# EAGLE schematic brobot19 (EAGLE 6.6.0)
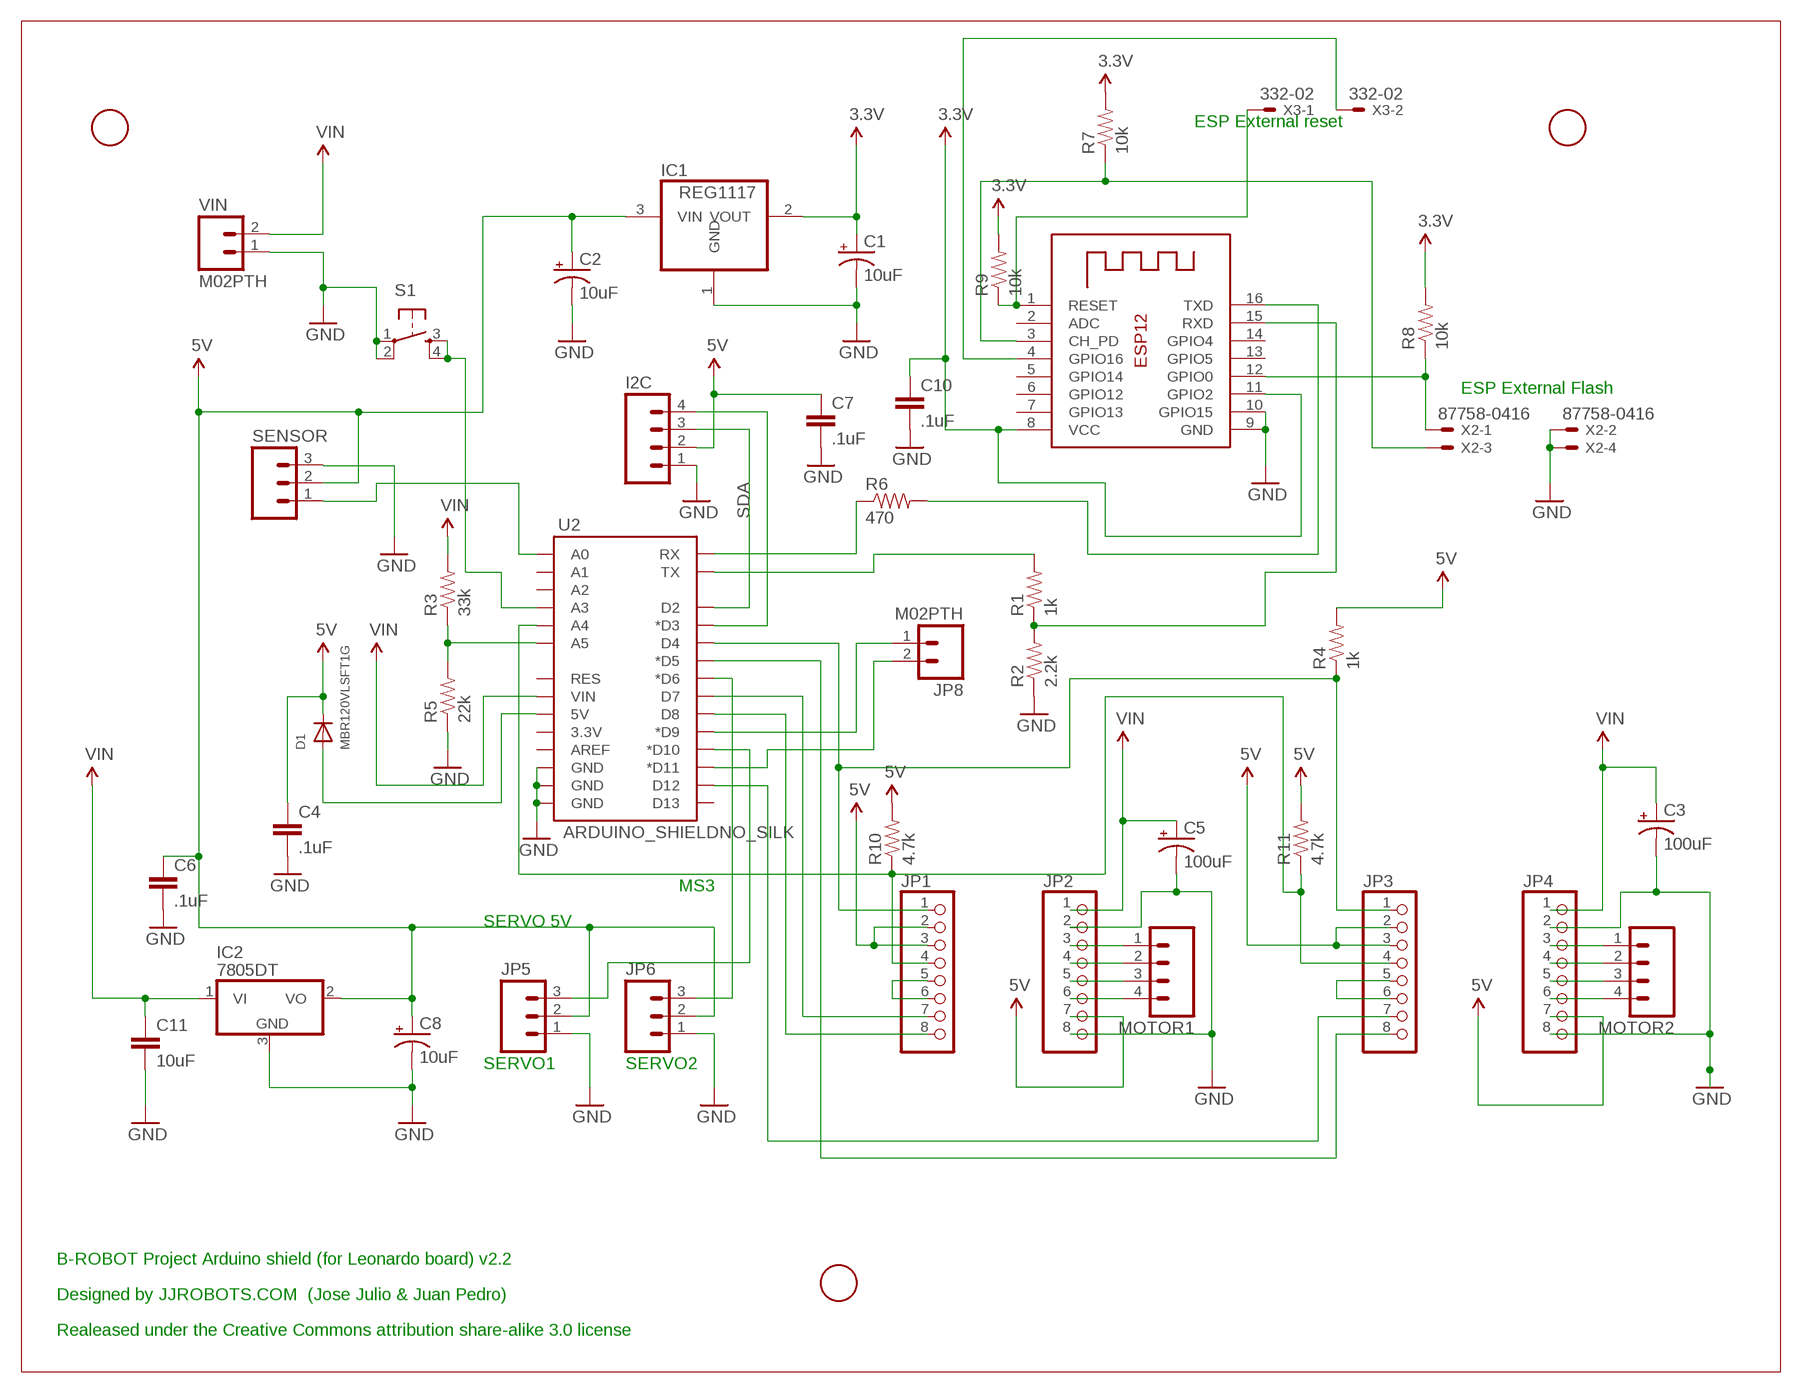
[diagram p0: schematic, sheet 1]

## Parts
C1  10uF  CAP_POL1206  [EIA3216]
C2  10uF  CAP_POL1206  [EIA3216]
C3  100uF  CAP_POLD  [PANASONIC_D]
C4  .1uF  CAP0402-CAP  [0402-CAP]
C5  100uF  CAP_POLD  [PANASONIC_D]
C6  .1uF  CAP0402-CAP  [0402-CAP]
C7  .1uF  CAP0402-CAP  [0402-CAP]
C8  10uF  CAP_POL1206  [EIA3216]
C10  .1uF  CAP0402-CAP  [0402-CAP]
C11  10uF  CAP1206  [1206]
D1  MBR120VLSFT1G  DIODESOD-123  [SOD-123]
I2C  M04PTH  [1X04]
IC1  REG1117  [SOT223]
IC2  7805DT  [TO252]
JP1  PINHD-1X8  [1X08]
JP2  PINHD-1X8  [1X08]
JP3  PINHD-1X8  [1X08]
JP4  PINHD-1X8  [1X08]
JP5  M03PTH  [1X03]
JP6  M03PTH  [1X03]
JP8  M02PTH  [1X02]
MOTOR1  M04PTH  [1X04]
MOTOR2  M04PTH  [1X04]
R1  1k  RESISTOR0805-RES  [0805]
R2  2.2k  RESISTOR0805-RES  [0805]
R3  33k  RESISTOR0805-RES  [0805]
R4  1k  RESISTOR0805-RES  [0805]
R5  22k  RESISTOR0805-RES  [0805]
R6  470  RESISTOR0805-RES  [0805]
R7  10k  RESISTOR0805-RES  [0805]
R8  10k  RESISTOR0805-RES  [0805]
R9  10k  RESISTOR0805-RES  [0805]
R10  4.7k  RESISTOR0805-RES  [0805]
R11  4.7k  RESISTOR0805-RES  [0805]
S1  TAC_SWITCHSMD  [TACTILE-SWITCH-SMD]
SENSOR  M03PTH  [1X03]
U2  ARDUINO_SHIELDNO_SILK  [DUEMILANOVE_VIAS]
U$1  FIDUCIAL  [FIDUCIAL_1MM]
U$2  FIDUCIAL  [FIDUCIAL_1MM]
U$3  FIDUCIAL  [FIDUCIAL_1MM]
VIN  M02PTH  [1X02]
X1  ESP-12  [ESP-12]
X2  87758-0416  [87758-0416]
X3  332-02  [332-02]

## Nets
3.3V: C1.A(+) C10.1 IC1.2(VOUT) R7.2 R8.2 R9.2 X1.8(VCC) X1.11(GPIO2)
5V: C2.A(+) C4.1 C6.1 C7.1 C8.A(+) D1.C I2C.2 IC1.3(VIN) IC2.2(VO) JP1.2 JP1.3 JP2.7 JP3.2 JP3.3 JP4.7 JP5.2 JP6.2 R4.2 R10.2 R11.2 SENSOR.2
GND: C1.C(-) C2.C(-) C3.- C4.2 C5.- C6.2 C7.2 C8.C(-) C10.2 C11.2 I2C.1 IC1.1(GND) IC2.3(GND) JP2.2 JP2.8 JP4.2 JP4.8 JP5.1 JP6.1 R2.1 R5.1 S1.1 S1.2 SENSOR.3 U2.GND@0(GND) U2.GND@1(GND) U2.GND@2(GND) VIN.1 X1.9(GND) X1.10(GPIO15) X2.2 X2.4
N$1: JP2.3 MOTOR1.1
N$2: JP2.4 MOTOR1.2
N$3: R6.2 X1.16(TXD)
N$4: R1.1 R2.2 X1.15(RXD)
N$5: R1.2 U2.TX
N$6: JP2.5 MOTOR1.3
N$7: JP2.6 MOTOR1.4
N$8: JP4.3 MOTOR2.1
N$9: JP4.4 MOTOR2.2
N$10: JP4.5 MOTOR2.3
N$11: JP1.5 JP1.6
N$12: JP3.5 JP3.6
N$13: R3.1 R5.2 U2.A5
N$14: R6.1 U2.RX
N$15: SENSOR.1 U2.A0
N$16: JP4.6 MOTOR2.4
N$17: JP6.3 U2.D6(*D6)
N$18: R7.1 X1.3(CH_PD) X2.3
N$19: JP5.3 U2.D10(*D10)
N$20: R8.1 X1.12(GPIO0) X2.1
N$21: JP1.8 U2.D8
N$22: JP1.7 U2.D7
N$23: JP1.1 JP3.1 R4.1 U2.D4
N$24: JP3.8 U2.D5(*D5)
N$25: JP3.7 U2.D12
N$26: D1.A U2.5V
N$27: JP8.1 U2.D9(*D9)
N$28: JP8.2 U2.D11(*D11)
N$29: R9.1 X1.1(RESET) X3.1
N$30: X1.4(GPIO16) X3.2
N$31: JP1.4 JP3.4 R10.1 R11.1 U2.A4
N$32: S1.3 S1.4 U2.A3
SCL: I2C.4 U2.D3(*D3)
SDA: I2C.3 U2.D2
VIN: C3.+ C5.+ C11.1 IC2.1(VI) JP2.1 JP4.1 R3.2 U2.VIN VIN.2
Unconnected: U2.3.3V U2.A1 U2.A2 U2.AREF U2.D13 U2.RES X1.2(ADC) X1.5(GPIO14) X1.6(GPIO12) X1.7(GPIO13) X1.13(GPIO5) X1.14(GPIO4)

## Notes on the sheet
- ESP External reset
- ESP External Flash
- MS3
- SERVO 5V
- SERVO1 | SERVO2
- B-ROBOT Project Arduino shield (for Leonardo board) v2.2
- Designed by JJROBOTS.COM  (Jose Julio & Juan Pedro)
- Realeased under the Creative Commons attribution share-alike 3.0 license

## Library data of the parts
C1-C3 C5 C8 = SparkFun-Passives:CAP_POL: Capacitor Polarized These are standard SMD and PTH capacitors. Normally 10uF, 47uF, and 100uF in electrolytic and tantalum varieties. Always verify the external diameter of the through hole cap, it varies with capacity, voltage, and manufacturer. The EIA devices should be standard.
C4 C6 C7 C10 C11 = SparkFun-Passives:CAP: Capacitor Standard 0603 ceramic capacitor, and 0.1" leaded capacitor.
D1 = adafruit:DIODE: Diode SMADIODE - SMA Surface Mount Package 20V 1A Schottky Diode Digikey: 641-1014-6-ND DO-1N4148 - Through Hole Small Current Diode SOD-123 20V 1 A (.5mV Vf) Schottky Diode - Digikey: MBRX120TPMSCT-ND SOD-323 10V 570mA (.38mV Vf, 3ns) Schottky Diode - Digikey: ZLLS410CT-ND SOD-523 30V 30mA Schottky Diode (RB751S-40TE61) - Digikey: RB751S-40TE61CT-ND SOT23-R/W - SOT23 Package (R = Solder Paste/Reflow Ovens, W = Hand-Soldering) BAT54Film 40V 300mA - Digikey: 497-7162-1-ND
I2C MOTOR1 MOTOR2 = SparkFun-Connectors:M04: Header 4 Standard 4-pin 0.1" header. Use with straight break away headers (SKU : PRT-00116), right angle break away headers (PRT-00553), swiss pins (PRT-00743), machine pins (PRT-00117), and female headers (PRT-00115). Molex polarized connector foot print use with SKU : PRT-08231 with associated crimp pins and housings. 1MM SMD Version SKU: PRT-10208
IC1 = burr-brown:REG1117: 800mA and 1A Low Dropout (LDO) Positive Regulator 1.8V, 2.5V, 2.85V, 3.3V, 5V, and Adj; MF: LM1117MPX-3.3/NOPB; MPN: REG1117; OC_FARNELL: 1097566; OC_NEWARK: 14P6981
IC2 = linear:78*: Positive VOLTAGE REGULATOR Source: http://cache.national.com/ds/LM/LM78L05.pdf http://www.fairchildsemi.com/ds/LM/LM7805.pdf
JP1-JP4 = pinhead:PINHD-1X8: PIN HEADER
JP5 JP6 SENSOR = SparkFun-Connectors:M03: Header 3 Standard 3-pin 0.1" header. Use with straight break away headers (SKU : PRT-00116), right angle break away headers (PRT-00553), swiss pins (PRT-00743), machine pins (PRT-00117), and female headers (PRT-00115). Molex polarized connector foot print use with SKU : PRT-08232 with associated crimp pins and housings.
JP8 VIN = SparkFun-Connectors:M02: Standard 2-pin 0.1" header. Use with - straight break away headers ( PRT-00116) - right angle break away headers (PRT-00553) - swiss pins (PRT-00743) - machine pins (PRT-00117) - female headers (PRT-00115) Molex polarized connector foot print use with: PRT-08233 with associated crimp pins and housings. 2.54_SCREWTERM for use with PRT-10571. 3.5mm Screw Terminal footprints for PRT-08084 5mm Screw Terminal footprints for use with PRT-08433
R1-R11 = SparkFun-Resistors:RESISTOR: Resistor Basic schematic elements and footprints for 0603, 1206, and PTH resistors.
S1 = SparkFun-Electromechanical:TAC_SWITCH: Momentary Switch Button commonly used for reset or general input. Spark Fun Electronics SKU : COM-00097 SMT- SWCH-08247
U2 = SparkFun-Boards:ARDUINO_SHIELD: Arduino shield footprint
U$1-U$3 = adafruit:FIDUCIAL: For use by pick and place machines to calibrate the vision/machine, 1mm By microbuilder.eu
X1 = adafruit:ESP-12
X2 = con-molex:87758-0416: 4 Pin - 2mm Dual Row Single Wafer, Vertical T/H HDR Source: http://www.molex.com/pdm_docs/sd/877580616_sd.pdf; MF: FARNELL; MPN: 87758-0416; OC_FARNELL: 7472315; OC_NEWARK: 39K3681
X3 = con-garry:332-02: 2 Pin - 2mm Dual Row Source: www.mpe-connector.de / garry_shortform_2012.pdf